# EAGLE design mpx20xx (EAGLE 7.1.0)
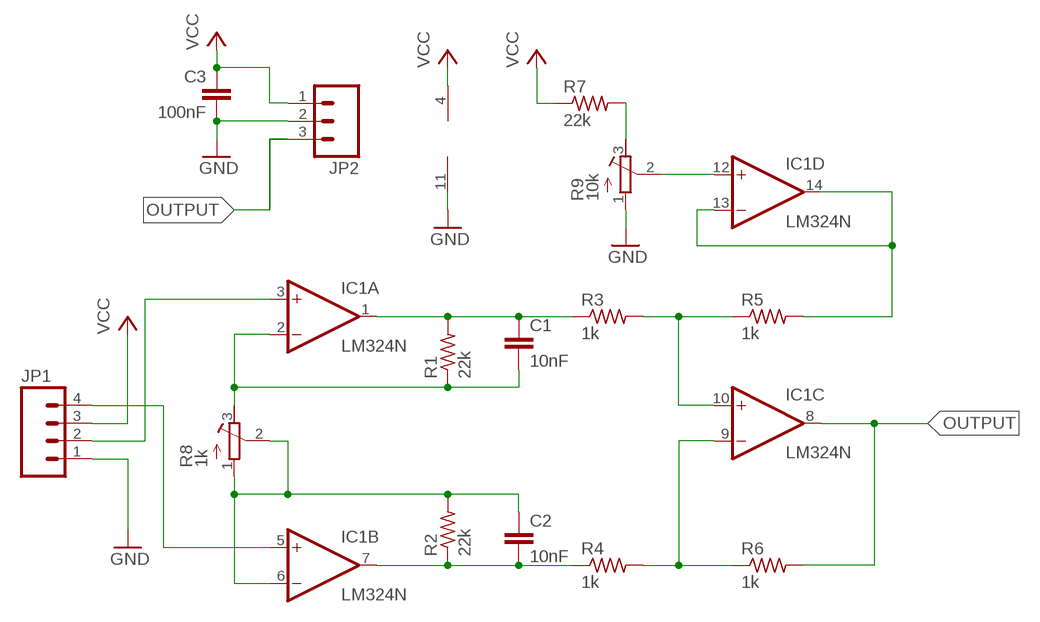
[diagram p0: schematic, sheet 1]

## Parts
C1  10nF  C-EU050-025X075  [C050-025X075]
C2  10nF  C-EU050-025X075  [C050-025X075]
C3  100nF  C-EU050-025X075  [C050-025X075]
IC1  LM324N  [DIL14]
JP1  M04LONGPADS  [1X04_LONGPADS]
JP2  M03LONGPADS  [1X03_LONGPADS]
R1  22k  R-US_0207/10  [0207/10]
R2  22k  R-US_0207/10  [0207/10]
R3  1k  R-US_0207/10  [0207/10]
R4  1k  R-US_0207/10  [0207/10]
R5  1k  R-US_0207/10  [0207/10]
R6  1k  R-US_0207/10  [0207/10]
R7  22k  R-US_0207/10  [0207/10]
R8  1k  R-TRIMM3299W  [RTRIM3299W]
R9  10k  R-TRIMM3299W  [RTRIM3299W]

## Nets
GND: C3.2 IC1.11(P:V-) JP1.1 JP2.2 R9.1(A)
N$1: IC1.3(A:+IN) JP1.2
N$2: IC1.5(B:+IN) JP1.4
N$3: C1.1 IC1.1(A:OUT) R1.2 R3.1
N$4: IC1.10(C:+IN) R3.2 R5.1
N$6: C1.2 IC1.2(A:-IN) R1.1 R8.3(E)
N$7: C2.2 IC1.7(B:OUT) R2.1 R4.1
N$8: IC1.9(C:-IN) R4.2 R6.1
N$9: C2.1 IC1.6(B:-IN) R2.2 R8.1(A) R8.2(S)
N$12: IC1.13(D:-IN) IC1.14(D:OUT) R5.2
N$14: IC1.12(D:+IN) R9.2(S)
N$15: R7.2 R9.3(E)
OUTPUT: IC1.8(C:OUT) JP2.3 R6.2
VCC: C3.1 IC1.4(P:V+) JP1.3 JP2.1 R7.1

## Library data of the parts
C1-C3 = resistor:C-EU: CAPACITOR, European symbol
IC1 = linear:LM324: OP AMP
JP1 = SparkFun-Connectors:M04: Header 4 Standard 4-pin 0.1" header. Use with straight break away headers (SKU : PRT-00116), right angle break away headers (PRT-00553), swiss pins (PRT-00743), machine pins (PRT-00117), and female headers (PRT-00115). Molex polarized connector foot print use with SKU : PRT-08231 with associated crimp pins and housings. 1MM SMD Version SKU: PRT-10208
JP2 = SparkFun-Connectors:M03: Header 3 Standard 3-pin 0.1" header. Use with straight break away headers (SKU : PRT-00116), right angle break away headers (PRT-00553), swiss pins (PRT-00743), machine pins (PRT-00117), and female headers (PRT-00115). Molex polarized connector foot print use with SKU : PRT-08232 with associated crimp pins and housings.
R1-R7 = resistor:R-US_: RESISTOR, American symbol
R8 R9 = rcl:R-TRIMM: Trimm resistor

## Net classes
0 default: width 0.254 mm, drill 0.508 mm, clearance 0.254 mm

## Board
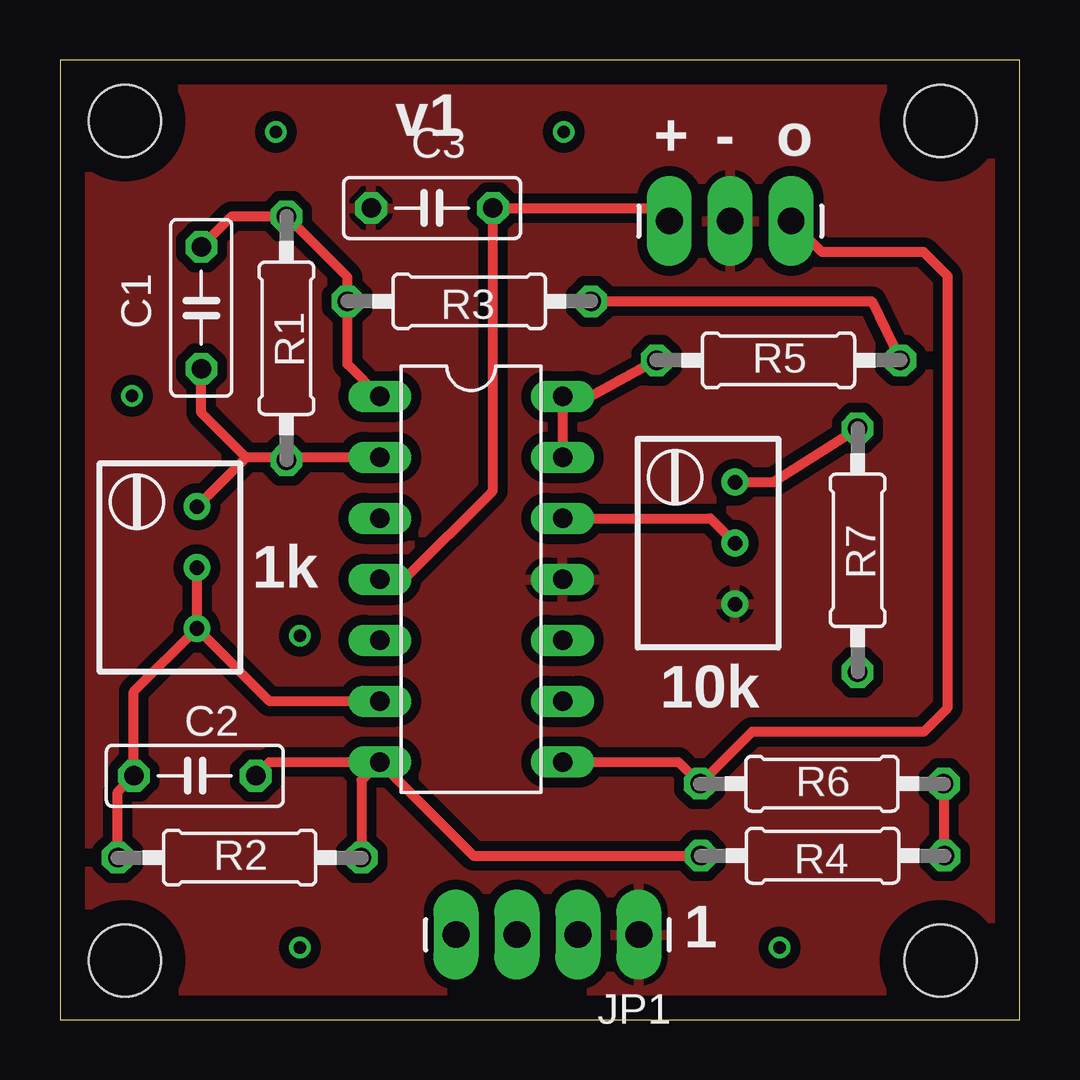
[diagram p1: board, top side]
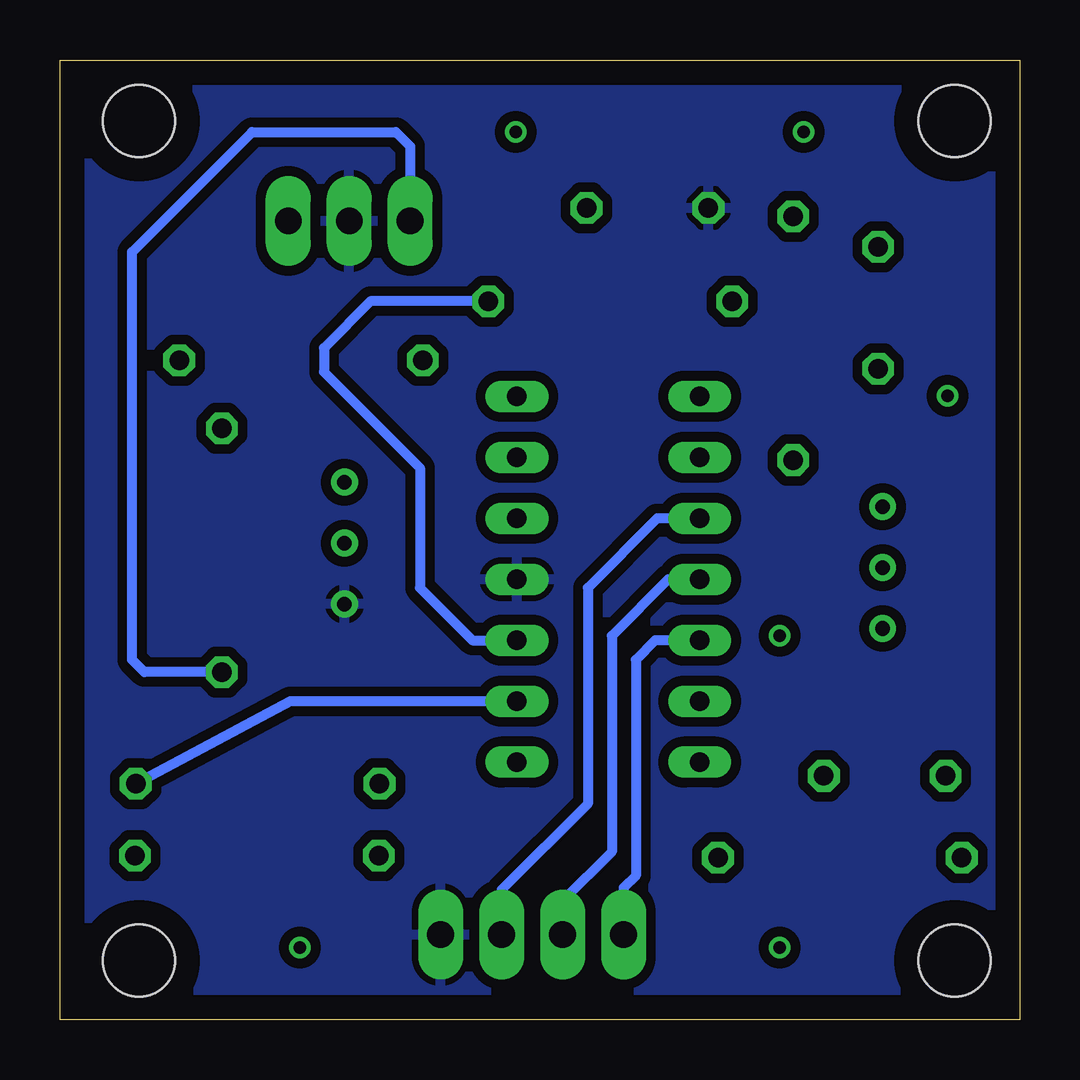
[diagram p2: board, bottom side, seen from below]

Size 40 x 40 mm. Coordinates in mm from the lower left corner, seen from the top.
Outline: 0,0 40,0 40,40 0,40 0,0
Copper layers (1*16): Top 0.035mm / dielectric 1.5mm / Bottom 0.035mm
Design rules "mpx_board": minimum track width 10mil, minimum drill 24mil, track to track 16mil, track to pad 16mil, pad to pad 10mil, via to via 10mil, smd to smd 10mil, copper to edge 40mil, drill to drill 8mil, minimum pad ring 10mil, minimum via ring 8mil, stop-mask expansion 4mil, vias tented up to drill 0mil, thermal gap 10mil
Holes 3 mm at 36.7,37.46 2.7,2.46 36.7,2.46 2.7,37.46

### Footprints (pad centres in the part's own frame; a part is rotated, then mirrored left to right if it is on the bottom)
C050-025X075 = drill 0.813 octagon: 1 -2.54,0; 2 2.54,0
DIL14 = drill 0.813 long: 1 -7.62,-3.81; 2 -5.08,-3.81; 3 -2.54,-3.81; 4 0,-3.81; 5 2.54,-3.81; 6 5.08,-3.81; 7 7.62,-3.81; 8 7.62,3.81; 9 5.08,3.81; 10 2.54,3.81; 11 0,3.81; 12 -2.54,3.81; 13 -5.08,3.81; 14 -7.62,3.81
1X04_LONGPADS = drill 1.118 pad 1.88 long: 1 0,0; 2 2.54,0; 3 5.08,0; 4 7.62,0
1X03_LONGPADS = drill 1.118 pad 1.88 long: 1 0,0; 2 2.54,0; 3 5.08,0
0207/10 = drill 0.813 octagon: 1 -5.08,0; 2 5.08,0
RTRIM3299W = drill 0.61: 1 1.27,-2.54; 2 1.27,0; 3 1.27,2.54

### Placement (x,y rotation side)
C1  5.89,29.67 270 top
C2  5.62,10.16 0 top
C3  15.51,33.83 180 top
IC1  17.14,18.35 270 top
JP1  24.13,3.54 180 top
JP2  25.4,33.29 0 top
R1  9.44,28.4 90 top
R2  7.49,6.75 180 top
R3  17.06,29.94 0 top
R4  31.79,6.83 0 top
R5  29.95,27.48 180 top
R6  31.76,9.83 180 top
R7  33.25,19.56 90 top
R8  4.44,18.84 0 top
R9  26.87,19.86 0 top

### Tracks (layer width: path | path; a pad name or v marks a point on that pad's centre or on a via)
GND
  pour Bottom: -3.27,43.54 -2.81,-3.27 44.27,-3.54 44.27,43.54
  pour Top: -1.27,41.91 -1.27,-1.27 41.91,-1.27 41.91,41.91
N$1
  Bottom 0.406: IC1.3 15.11,20.89 18,18 18,9 21.59,5.41 JP1.2
N$2
  Bottom 0.406: IC1.5 15.19,15.81 16,15 16,6 16.51,5.49 JP1.4
N$3
  Top 0.406: C1.1 7.16,33.48 R1.2 11.98,30.94 R3.1 11.98,27.32 IC1.1
N$4
  Top 0.406: R3.2 33.84,29.94 R5.1
  Bottom 0.406: R3.2 27.06,29.94 29,28 29,27 25,23 25,18 22.81,15.81 IC1.10
N$5  (via drill 0.51)
  other vias: 10,3
N$6
  Top 0.254: 9.55,23.43 R1.1
  Top 0.406: IC1.2 9.55,23.43 7.76,23.43 | 7.76,23.43 R8.3 | 7.76,23.43 5.89,25.3 C1.2
N$7
  Top 0.406: IC1.7 12.57,9.97 R2.1 | IC1.7 17.23,6.83 R4.1 | C2.2 8.73,10.73 IC1.7
N$8
  Top 0.406: R6.1 36.84,6.86 R4.2
  Bottom 0.406: IC1.9 30.4,13.27 R6.1
N$9
  Top 0.406: R8.1 R8.2 | IC1.6 8.74,13.27 R8.1 | R8.1 3.08,13.67 C2.1 2.41,9.49 R2.2
N$10  (via drill 0.51)
  other vias: 30,3
N$11  (via drill 0.51)
  other vias: 21,37
N$12
  Top 0.406: R5.2 22.09,25.97 IC1.14 IC1.13
N$13  (via drill 0.51)
  other vias: 9,37
N$14
  Top 0.406: IC1.12 27.11,20.89 R9.2
N$15
  Top 0.406: R9.3 29.74,22.4 R7.2
N$16  (via drill 0.51)
  other vias: 10,16
N$17  (via drill 0.51)
  other vias: 3,26
OUTPUT
  Top 0.406: IC1.8 25.78,10.73 R6.2 28.85,12 36,12 37,13 37,31 36,32 31.77,32 JP2.3
  Bottom 0.406: JP2.3
VCC
  Top 0.254: 18,22 18.05,22.05
  Top 0.406: 18,22 14.35,18.35 IC1.4 | 18.05,22.05 C3.1 24.86,33.83 JP2.1
  Bottom 0.406: IC1.4 14.65,18.35 17,16 17,7 19.05,4.95 JP1.3 | JP2.1 25.4,36.4 26,37 32,37 37,32 37,15 36.48,14.48 R7.1

### Text on the board
tPlace: v1 | + | - | o | 1k | 10k | 1